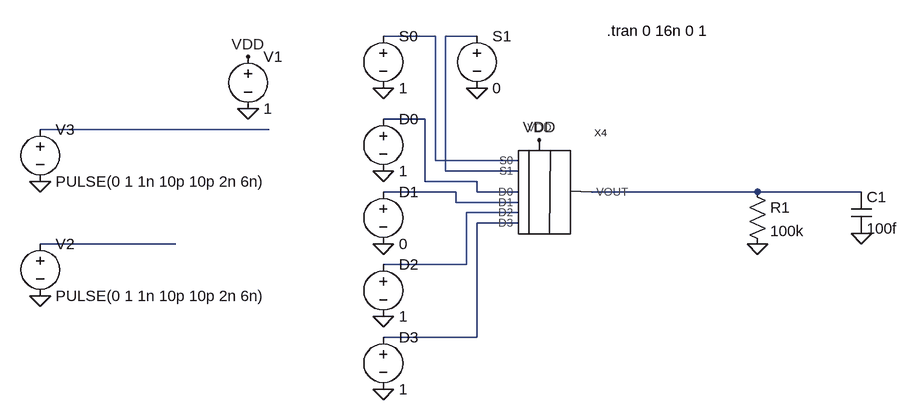
[diagram p0: schematic Draft4.asc]
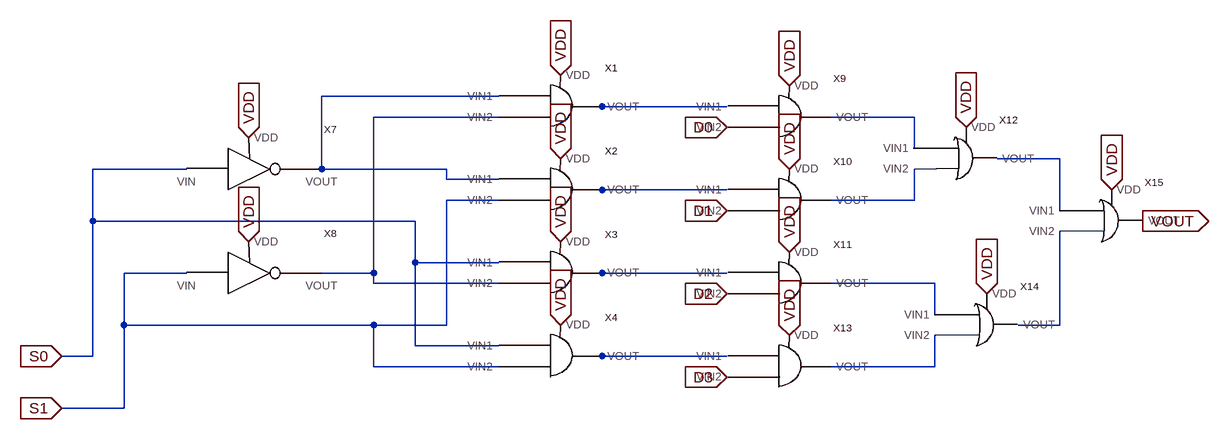
[diagram p1: sub-circuit boe.asc]
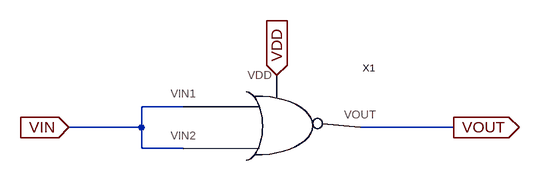
[diagram p2: sub-circuit not.asc]
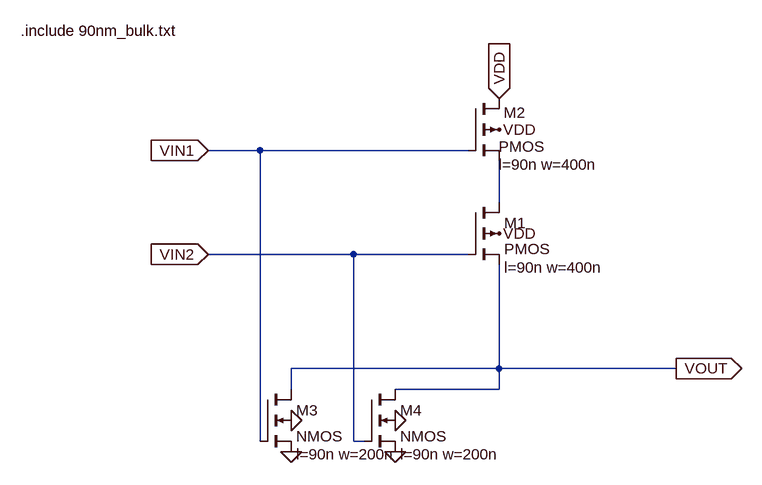
[diagram p3: sub-circuit nor.asc]
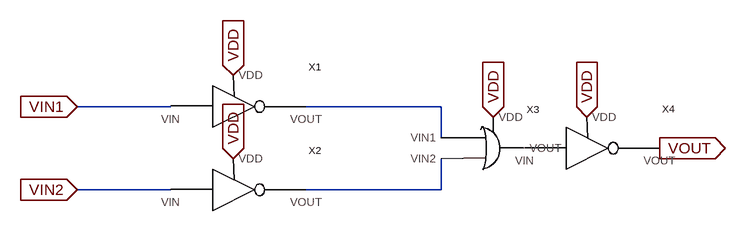
[diagram p4: sub-circuit and.asc]
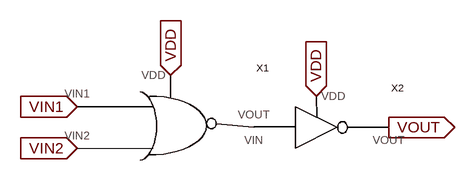
[diagram p5: sub-circuit or.asc]
Draft4.asc, the LTspice schematic file:
Version 4
SHEET 1 880 680
WIRE 96 -80 16 -80
WIRE 160 -80 112 -80
WIRE 80 48 16 48
WIRE -160 64 -512 64
WIRE 96 112 96 -80
WIRE 224 112 96 112
WIRE 112 128 112 -80
WIRE 224 128 112 128
WIRE 80 144 80 48
WIRE 160 144 80 144
WIRE 128 160 16 160
WIRE 160 160 160 144
WIRE 224 160 160 160
WIRE 592 160 336 160
WIRE 752 160 592 160
WIRE 128 176 128 160
WIRE 224 176 128 176
WIRE 224 192 144 192
WIRE 224 208 160 208
WIRE -304 240 -512 240
WIRE 144 272 144 192
WIRE 144 272 16 272
WIRE 160 384 160 208
WIRE 160 384 16 384
FLAG -192 32 0
FLAG -512 144 0
FLAG -512 320 0
FLAG 256 80 VDD
FLAG -192 -48 VDD
FLAG 592 240 0
FLAG 752 224 0
FLAG 16 128 0
FLAG 16 240 0
FLAG 16 352 0
FLAG 16 464 0
FLAG 16 0 0
FLAG 160 0 0
SYMBOL voltage -192 -64 R0
WINDOW 123 0 0 Left 0
WINDOW 39 0 0 Left 0
SYMATTR InstName V1
SYMATTR Value 1
SYMBOL voltage -512 224 R0
WINDOW 123 0 0 Left 0
WINDOW 39 0 0 Left 0
SYMATTR InstName V2
SYMATTR Value PULSE(0 1 1n 10p 10p 2n 6n)
SYMBOL voltage -512 48 R0
WINDOW 123 0 0 Left 0
WINDOW 39 0 0 Left 0
SYMATTR InstName V3
SYMATTR Value PULSE(0 1 1n 10p 10p 2n 6n)
SYMBOL res 576 144 R0
SYMATTR InstName R1
SYMATTR Value 100k
SYMBOL cap 736 160 R0
SYMATTR InstName C1
SYMATTR Value 100f
SYMBOL boe 304 160 R0
SYMATTR InstName X4
SYMBOL voltage 16 32 R0
WINDOW 123 0 0 Left 0
WINDOW 39 0 0 Left 0
SYMATTR InstName D0
SYMATTR Value 1
SYMBOL voltage 16 144 R0
WINDOW 123 0 0 Left 0
WINDOW 39 0 0 Left 0
SYMATTR InstName D1
SYMATTR Value 0
SYMBOL voltage 16 256 R0
WINDOW 123 0 0 Left 0
WINDOW 39 0 0 Left 0
SYMATTR InstName D2
SYMATTR Value 1
SYMBOL voltage 16 368 R0
WINDOW 123 0 0 Left 0
WINDOW 39 0 0 Left 0
SYMATTR InstName D3
SYMATTR Value 1
SYMBOL voltage 16 -96 R0
WINDOW 123 0 0 Left 0
WINDOW 39 0 0 Left 0
SYMATTR InstName S0
SYMATTR Value 1
SYMBOL voltage 160 -96 R0
WINDOW 123 0 0 Left 0
WINDOW 39 0 0 Left 0
SYMATTR InstName S1
SYMATTR Value 0
TEXT 360 -88 Left 2 !.tran 0 16n 0 1

boe.asc, the sub-circuit schematic file:
Version 4
SHEET 1 1308 1032
WIRE 112 480 -160 480
WIRE 272 496 256 496
WIRE 464 496 272 496
WIRE 112 512 -80 512
WIRE 752 512 624 512
WIRE 752 560 752 512
WIRE 976 576 880 576
WIRE -368 592 -512 592
WIRE -160 592 -160 480
WIRE 32 592 -160 592
WIRE 32 608 32 592
WIRE 112 608 32 608
WIRE 272 624 256 624
WIRE 464 624 272 624
WIRE 112 640 32 640
WIRE 752 640 752 592
WIRE 752 640 624 640
WIRE 976 656 976 576
WIRE -512 672 -512 592
WIRE -16 672 -512 672
WIRE -16 736 -16 672
WIRE 112 736 -16 736
WIRE -368 752 -464 752
WIRE -80 752 -80 512
WIRE -80 752 -160 752
WIRE 272 752 256 752
WIRE 464 752 272 752
WIRE -80 768 -80 752
WIRE 112 768 -80 768
WIRE 784 768 624 768
WIRE 784 816 784 768
WIRE -464 832 -464 752
WIRE -80 832 -464 832
WIRE 32 832 32 640
WIRE 32 832 -80 832
WIRE 976 832 976 688
WIRE 976 832 912 832
WIRE -16 864 -16 736
WIRE 112 864 -16 864
WIRE -512 880 -512 672
WIRE -512 880 -560 880
WIRE 272 880 256 880
WIRE 464 880 272 880
WIRE -80 896 -80 832
WIRE 112 896 -80 896
WIRE 784 896 784 848
WIRE 784 896 624 896
WIRE -464 960 -464 832
WIRE -464 960 -560 960
FLAG -560 960 S1
IOPIN -560 960 In
FLAG -560 880 S0
IOPIN -560 880 In
FLAG 464 528 D0
IOPIN 464 528 In
FLAG 464 656 D1
IOPIN 464 656 In
FLAG 464 784 D2
IOPIN 464 784 In
FLAG 464 912 D3
IOPIN 464 912 In
FLAG 208 448 VDD
IOPIN 208 448 In
FLAG 208 576 VDD
IOPIN 208 576 In
FLAG 208 704 VDD
IOPIN 208 704 In
FLAG 208 832 VDD
IOPIN 208 832 In
FLAG -272 704 VDD
IOPIN -272 704 In
FLAG -272 544 VDD
IOPIN -272 544 In
FLAG 560 464 VDD
IOPIN 560 464 In
FLAG 560 592 VDD
IOPIN 560 592 In
FLAG 560 720 VDD
IOPIN 560 720 In
FLAG 560 848 VDD
IOPIN 560 848 In
FLAG 832 528 VDD
IOPIN 832 528 In
FLAG 864 784 VDD
IOPIN 864 784 In
FLAG 1056 624 VDD
IOPIN 1056 624 In
FLAG 1104 672 VOUT
IOPIN 1104 672 Out
SYMBOL not -256 592 R0
SYMATTR InstName X7
SYMBOL not -256 752 R0
SYMATTR InstName X8
SYMBOL and 576 512 R0
SYMATTR InstName X9
SYMBOL and 576 640 R0
SYMATTR InstName X10
SYMBOL and 576 768 R0
SYMATTR InstName X11
SYMBOL and 576 896 R0
SYMATTR InstName X13
SYMBOL or 816 576 R0
SYMATTR InstName X12
SYMBOL or 848 832 R0
SYMATTR InstName X14
SYMBOL or 1040 672 R0
SYMATTR InstName X15
SYMBOL and 224 496 R0
SYMATTR InstName X1
SYMBOL and 224 624 R0
SYMATTR InstName X2
SYMBOL and 224 752 R0
SYMATTR InstName X3
SYMBOL and 224 880 R0
SYMATTR InstName X4

not.asc, the sub-circuit schematic file:
Version 4
SHEET 1 880 680
WIRE 80 144 16 144
WIRE 16 176 16 144
WIRE 16 176 -96 176
WIRE 496 176 352 176
WIRE 16 208 16 176
WIRE 80 208 16 208
FLAG -96 176 VIN
IOPIN -96 176 In
FLAG 496 176 VOUT
IOPIN 496 176 Out
FLAG 224 96 VDD
IOPIN 224 96 In
SYMBOL nor 240 144 R0
SYMATTR InstName X1

nor.asc, the sub-circuit schematic file:
Version 4
SHEET 1 992 680
WIRE -240 192 -320 192
WIRE 80 192 -240 192
WIRE 128 272 128 208
WIRE -96 352 -320 352
WIRE 80 352 -96 352
WIRE 128 528 128 368
WIRE 128 528 -192 528
WIRE 400 528 128 528
WIRE -192 560 -192 528
WIRE 128 560 128 528
WIRE 128 560 -32 560
WIRE -240 640 -240 192
WIRE -96 640 -96 352
WIRE -80 640 -96 640
FLAG 128 160 VDD
FLAG -192 656 0
FLAG -32 656 0
FLAG -32 608 0
FLAG -192 608 0
FLAG 128 320 VDD
FLAG -320 192 VIN1
IOPIN -320 192 In
FLAG -320 352 VIN2
IOPIN -320 352 In
FLAG 400 528 VOUT
IOPIN 400 528 Out
FLAG 128 112 VDD
IOPIN 128 112 In
SYMBOL pmos4 80 112 R0
WINDOW 0 55 22 Left 2
WINDOW 3 47 74 Left 2
WINDOW 123 47 102 Left 2
SYMATTR InstName M2
SYMATTR Value2 l=90n w=400n
SYMBOL pmos4 80 272 R0
WINDOW 123 56 100 Left 2
SYMATTR Value2 l=90n w=400n
SYMATTR InstName M1
SYMBOL nmos4 -240 560 R0
WINDOW 123 56 100 Left 2
SYMATTR Value2 l=90n w=200n
SYMATTR InstName M3
SYMBOL nmos4 -80 560 R0
WINDOW 123 56 100 Left 2
SYMATTR Value2 l=90n w=200n
SYMATTR InstName M4
TEXT -608 8 Left 2 !.include 90nm_bulk.txt

and.asc, the sub-circuit schematic file:
Version 4
SHEET 1 956 680
WIRE 112 112 -32 112
WIRE 528 112 320 112
WIRE 528 160 528 112
WIRE 112 240 -32 240
WIRE 528 240 528 192
WIRE 528 240 320 240
FLAG -32 112 VIN1
IOPIN -32 112 In
FLAG -32 240 VIN2
IOPIN -32 240 In
FLAG 208 64 VDD
IOPIN 208 64 In
FLAG 752 128 VDD
IOPIN 752 128 In
FLAG 208 192 VDD
IOPIN 208 192 In
FLAG 864 176 VOUT
IOPIN 864 176 Out
FLAG 608 128 VDD
IOPIN 608 128 In
SYMBOL not 224 112 R0
SYMATTR InstName X1
SYMBOL not 224 240 R0
SYMATTR InstName X2
SYMBOL not 768 176 R0
SYMATTR InstName X4
SYMBOL or 592 176 R0
SYMATTR InstName X3

or.asc, the sub-circuit schematic file:
Version 4
SHEET 1 880 680
FLAG 48 128 VIN1
IOPIN 48 128 In
FLAG 48 192 VIN2
IOPIN 48 192 In
FLAG 528 160 VOUT
IOPIN 528 160 Out
FLAG 192 80 VDD
IOPIN 192 80 In
FLAG 416 112 VDD
IOPIN 416 112 In
SYMBOL nor 208 128 R0
SYMATTR InstName X1
SYMBOL not 432 160 R0
SYMATTR InstName X2

The netlist it stands for:
* Draft4.asc
V1 VDD 0 1
V2 N009 0 PULSE(0 1 1n 10p 10p 2n 6n)
V3 N004 0 PULSE(0 1 1n 10p 10p 2n 6n)
R1 N006 0 100k
C1 N006 0 100f
XX4 N001 N002 N003 N007 N008 N005 VDD N006 boe
V§D0 N003 0 1
V§D1 N005 0 0
V§D2 N007 0 1
V§D3 N008 0 1
V§S0 N001 0 1
V§S1 N002 0 0

* block symbol definitions
.subckt boe S0 S1 D0 D2 D3 D1 VDD VOUT
XX7 S0 N001 VDD not
XX8 S1 N003 VDD not
XX9 N002 D0 N004 VDD and
XX10 N006 D1 N007 VDD and
XX11 N008 D2 N009 VDD and
XX13 N011 D3 N012 VDD and
XX12 N004 N007 N005 VDD or
XX14 N009 N012 N010 VDD or
XX15 N005 N010 VOUT VDD or
XX1 N001 N003 N002 VDD and
XX2 N001 S1 N006 VDD and
XX3 S0 N003 N008 VDD and
XX4 S0 S1 N011 VDD and
.ends boe

.subckt not VIN VOUT VDD
XX1 VIN VIN VOUT VDD nor
.ends not

.subckt nor VIN1 VIN2 VOUT VDD
M2 VDD VIN1 N001 VDD PMOS l=90n w=400n
M1 N001 VIN2 VOUT VDD PMOS l=90n w=400n
M3 VOUT VIN1 0 0 NMOS l=90n w=200n
M4 VOUT VIN2 0 0 NMOS l=90n w=200n
.include 90nm_bulk.txt
.ends nor

.subckt and VIN1 VIN2 VOUT VDD
XX1 VIN1 N001 VDD not
XX2 VIN2 N002 VDD not
XX4 P001 VOUT VDD not
XX3 N001 N002 P001 VDD or
.ends and

.subckt or VIN1 VIN2 VOUT VDD
XX1 VIN1 VIN2 P001 VDD nor
XX2 P001 VOUT VDD not
.ends or

.model NMOS NMOS
.model PMOS PMOS
.lib standard.mos
.tran 0 16n 0 1
.backanno
.end